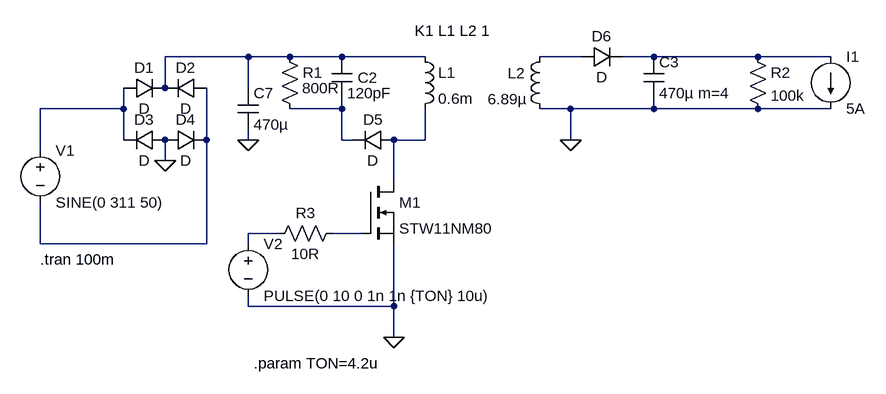
[diagram p0: schematic 120W-Flayback.asc]
120W-Flayback.asc, the LTspice schematic file:
Version 4.1
SHEET 1 1580 680
WIRE 416 -48 288 -48
WIRE 480 -48 416 -48
WIRE 560 -48 480 -48
WIRE 688 -48 560 -48
WIRE 928 -48 864 -48
WIRE 1040 -48 992 -48
WIRE 1200 -48 1040 -48
WIRE 1312 -48 1200 -48
WIRE 288 0 288 -48
WIRE 416 0 416 -48
WIRE 224 32 224 0
WIRE 224 32 96 32
WIRE 560 32 560 16
WIRE 560 32 480 32
WIRE 912 32 864 32
WIRE 1040 32 1040 16
WIRE 1040 32 912 32
WIRE 1200 32 1040 32
WIRE 1312 32 1200 32
WIRE 224 80 224 32
WIRE 352 80 352 0
WIRE 416 80 416 64
WIRE 560 80 560 32
WIRE 576 80 560 80
WIRE 688 80 688 32
WIRE 688 80 640 80
WIRE 912 80 912 32
WIRE 96 96 96 32
WIRE 288 112 288 80
WIRE 640 144 640 80
WIRE 464 224 416 224
WIRE 592 224 544 224
WIRE 96 240 96 176
WIRE 352 240 352 80
WIRE 352 240 96 240
WIRE 416 240 416 224
WIRE 416 336 416 320
WIRE 640 336 640 240
WIRE 640 336 416 336
WIRE 640 384 640 336
FLAG 288 112 0
FLAG 640 384 0
FLAG 912 80 0
FLAG 416 80 0
SYMBOL voltage 96 80 R0
WINDOW 123 0 0 Left 0
WINDOW 39 0 0 Left 0
SYMATTR InstName V1
SYMATTR Value SINE(0 311 50)
SYMBOL diode 224 16 R270
WINDOW 0 32 32 VTop 2
WINDOW 3 0 32 VBottom 2
SYMATTR InstName D1
SYMBOL diode 352 -16 R90
WINDOW 0 0 32 VBottom 2
WINDOW 3 32 32 VTop 2
SYMATTR InstName D2
SYMBOL diode 288 64 R90
WINDOW 0 0 32 VBottom 2
WINDOW 3 32 32 VTop 2
SYMATTR InstName D3
SYMBOL diode 288 96 R270
WINDOW 0 32 32 VTop 2
WINDOW 3 0 32 VBottom 2
SYMATTR InstName D4
SYMBOL res 464 -64 R0
WINDOW 3 35 64 Left 2
SYMATTR InstName R1
SYMATTR Value 800R
SYMBOL cap 544 -48 R0
WINDOW 0 40 32 Left 2
SYMATTR InstName C2
SYMATTR Value 120pF
SYMATTR SpiceLine Rser=10m
SYMBOL diode 640 64 R90
WINDOW 0 0 32 VBottom 2
WINDOW 3 32 32 VTop 2
SYMATTR InstName D5
SYMBOL ind 672 -64 R0
SYMATTR InstName L1
SYMATTR Value 0.6m
SYMATTR Type ind
SYMATTR SpiceLine Rser=1m
SYMBOL ind 880 48 R180
WINDOW 0 38 71 Left 2
WINDOW 3 35 31 Left 2
SYMATTR InstName L2
SYMATTR Value 6.89µ
SYMATTR Type ind
SYMATTR SpiceLine Rser=1m
SYMBOL lib\\sym\\nmos 592 144 R0
SYMATTR InstName M1
SYMATTR Value STW11NM80
SYMBOL voltage 416 224 R0
WINDOW 123 0 0 Left 0
WINDOW 39 0 0 Left 0
SYMATTR InstName V2
SYMATTR Value PULSE(0 10 0 1n 1n {TON} 10u)
SYMBOL diode 928 -32 R270
WINDOW 0 32 32 VTop 2
WINDOW 3 0 32 VBottom 2
SYMATTR InstName D6
SYMBOL cap 1024 -48 R0
SYMATTR InstName C3
SYMATTR Value 470µ m=4
SYMATTR SpiceLine Rser=10m
SYMBOL res 1184 -64 R0
SYMATTR InstName R2
SYMATTR Value 100k
SYMBOL lib\\sym\\current 1312 -48 R0
WINDOW 123 0 0 Left 0
WINDOW 39 0 0 Left 0
SYMATTR InstName I1
SYMATTR Value 5A
SYMBOL res 560 208 R90
WINDOW 0 0 56 VBottom 2
WINDOW 3 32 56 VTop 2
SYMATTR InstName R3
SYMATTR Value 10R
SYMBOL cap 400 0 R0
SYMATTR InstName C7
SYMATTR Value 470µ
SYMATTR SpiceLine Rser=10m
TEXT 96 264 Left 2 !.tran 100m
TEXT 672 -88 Left 2 !K1 L1 L2 1
TEXT 424 424 Left 2 !.param TON=4.2u

The netlist it stands for:
* 120W-Flayback.asc
V1 N004 N006 SINE(0 311 50)
D1 N004 N001 D
D2 N006 N001 D
D3 0 N004 D
D4 0 N006 D
R1 N001 N005 800R
C2 N001 N005 120pF Rser=10m
D5 N007 N005 D
L1 N001 N007 0.6m Rser=1m
L2 0 N002 6.89µ Rser=1m
M1 N007 N009 0 0 STW11NM80
V2 N008 0 PULSE(0 10 0 1n 1n {TON} 10u)
D6 N002 N003 D
C3 N003 0 470µ m=4 Rser=10m
R2 N003 0 100k
I1 N003 0 5A
R3 N009 N008 10R
C7 N001 0 470µ Rser=10m
.model D D
.lib standard.dio
.model NMOS NMOS
.model PMOS PMOS
.lib standard.mos
.tran 100m
K1 L1 L2 1
.param TON=4.2u
.backanno
.end